# Altium project PCB.PrjPcb
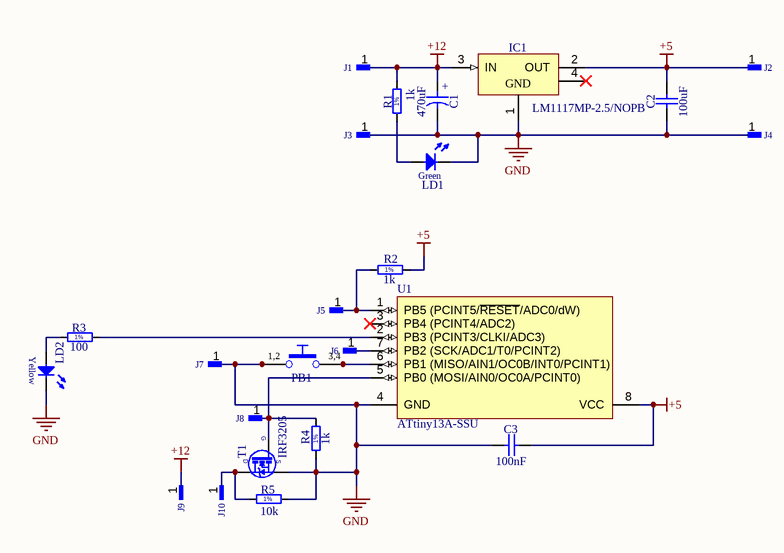
[diagram p0: Sheet1.SchDoc]
1 sheet, 24 parts. Net scope: global (net labels, ports and power ports of the same name join across sheets).
Board file: PCB1.PcbDoc

## Sheet Sheet1.SchDoc
size A4; Date: 24.01.2021; SheetNumber: 1; SheetTotal: 1

### Parts
C1  470uF  [CAPPR500-1050X1150]
C2  100uF  [CAPC3216X180N]
C3  100nF  [CAPC2012X135N]
IC1  LM1117MP-2.5/NOPB  [SOT230P700X180-4N]
J1  SMD Pad  [R400X300]  (value not drawn)
J2  SMD Pad  [R400X300]  (value not drawn)
J3  SMD Pad  [R400X300]  (value not drawn)
J4  SMD Pad  [R400X300]  (value not drawn)
J5  SMD Pad  [R350X200]  (value not drawn)
J6  SMD Pad  [R400X300]  (value not drawn)
J7  SMD Pad  [R350X200]  (value not drawn)
J8  SMD Pad  [R350X200]  (value not drawn)
J9  SMD Pad  [R400X300]  (value not drawn)
J10  SMD Pad  [R400X300]  (value not drawn)
LD1  Green  [LED_3MM_GREEN_1C-2A]  (value not drawn)
LD2  Yellow  [LED_3MM_YELLOW_1C-2A]  (value not drawn)
PB1  Push Button  [PB_ALPS_SKHHDTA010]  (value not drawn)
R1  1k  [RESC2012X60N]
R2  1k  [RESC2012X60N]
R3  100  [RESC2012X60N]
R4  1k  [RESC2012X60N]
R5  10k  [RESC2012X60N]
T1  IRF3205  [TO-220-V]
U1  ATtiny13A-SSU  [8S1_N]

### Nets
+5: C2.2 C3.2 IC1.2(OUT) J2.1 R2.2 U1.8(VCC)
+12: C1.1 IC1.3(IN) J1.1 J9.1 R1.2
GND: C1.2 C2.1 C3.1 IC1.1(GND) J3.1 J4.1 J7.1 LD1.1(C) LD2.1(C) PB1.1 PB1.2 R4.1 R5.2 T1.3(S) U1.4(GND)
NetJ5_1: J5.1 R2.1 U1.1(PB5_(PCINT5/~{RESET}/ADC0/dW))
NetJ6_1: J6.1 U1.7(PB2_(SCK/ADC1/T0/PCINT2))
NetJ8_1: J8.1 R4.2 T1.1(G) U1.5(PB0_(MOSI/AIN0/OC0A/PCINT0))
NetJ10_1: J10.1 R5.1 T1.2(D)
NetLD1_2: LD1.2(A) R1.1
NetLD2_2: LD2.2(A) R3.1
NetPB1_3: PB1.3 PB1.4 U1.6(PB1_(MISO/AIN1/OC0B/INT0/PCINT1))
NetR3_2: R3.2 U1.2(PB3_(PCINT3/CLKI/ADC3))

Not connected (* = marked no-connect by the designer): IC1 4(OUT)*; U1 3(PB4_(PCINT4/ADC2))*

### Notes on the sheet
- DWG. NO.
- REV.
- SHT.
- THIS DOCUMENT AND THE DATA DISCLOSED HEREIN OR HEREWITH IS THE PROPERTY OF ALTIUM LIMITED AND MAY BE FREELY DISTRIBUTED IN WHOLE. NO RIGHTS ARE RESERVED OR EXPRESS OR IMPLIED WARANTEE GIVEN.
- REVISION
- DESCRIPTION
- DATE
- APPROVED
- ENG:
- APPROVALS
- PROJECT
- DSN:
- CHK:
- REFERENCE DOCUMENTS
- PROJECT REVISION:
- TITLE
- DOCUMENT REVISION:
- DESIGN ITEM:
- BOM:
- FAB DWG:
- PCB DWG:
- ASSY DWG:
- SCALE:
- SIZE
- B
- CAGE CODE
- FILE NAME
- DWG NO.
- SHEET
- OF
- REV
- (in symbol CAER_470UF_10V_20%_500-1050X1150_LESR0R015) +
- (in symbol PB_ALPS_SKHHDTA010) 1,2; 3,4
- (in symbol R0805_1K_1%_0.33W_100PPM_VISHAY_CRCW-HP) 1%
- (in symbol R0805_10K_1%_0.125W_100PPM) 1%
- (in symbol R0805_100R_1%_0.125W_100PPM) 1%

### Library data of the parts
C1 = CAER_470UF_10V_20%_500-1050X1150_LESR0R015: Polarised capacitor; Part Description: Low ESR 0R015 Aluminum Solid Capacitor With Organic Semiconductive Electrolyte; Manufacturer: SANYO OS-CON; Manufacturer Part Number: 10SP470M; Voltage: 10V; Tolerance: ±20%; Part Number: CAER_470UF_10V_20%_500-1050X1150_LESR0R015; Component Kind: Standard; Component Type: Standard; Pin Count: 2; Value: 470uF; Status: Obsolete; Case: LS5 D10.5 x H11.5; Mounted: Yes; Socket: No; SMD: No; Sense: No; ComponentHeight: 11.5mm; HelpURL: \\cern.ch\dfs\Applications\Altium\Datasheets\CAER-LESR_SANYO_SP.pdf; Author: CERN DEM JLC; CreateDate: 29.01.2008; LatestRevisionDate: 16.03.2009
C2 = CC1206_100UF_6.3V_20%_X5R: Non-polarised capacitor; Part Description: SMD Multilayer Chip Ceramic Capacitor; Manufacturer: GENERIC; Manufacturer1 Part Number: C1206C107M9PACTU; Voltage: 6.3V; TC: X5R; Tolerance: ±10%; Part Number: CC1206_100UF_6.3V_20%_X5R; Component Kind: Standard; Component Type: Standard; Pin Count: 2; Value: 100uF; Status: None; Manufacturer Part Number: CC1206_100UF_6.3V_20%_X5R; Case: 1206; Mounted: Yes; Socket: No; SMD: Yes; Sense: No; Manufacturer1 Example: KEMET; Manufacturer1 ComponentHeight: 1.8mm; HelpURL: \\cern.ch\dfs\Applications\Altium\Datasheets\CC1206_X5R_KEMET.pdf; Author: CERN DEM JLC; CreateDate: 26.09.2012; LatestRevisionDate: 26.09.2012
C3 = CC0805_100NF_50V_10%_X7R: Non-polarised capacitor; Part Description: SMD Multilayer Chip Ceramic Capacitor; Manufacturer: GENERIC; Manufacturer1 Part Number: C2012X7R1H104K085AA; Voltage: 50V; TC: X7R; Tolerance: ±10%; Part Number: CC0805_100NF_50V_10%_X7R; Component Kind: Standard; Component Type: Standard; Pin Count: 2; Value: 100nF; Status: Preferred; Manufacturer Part Number: CC0805_100NF_50V_10%_X7R; Case: 0805; Mounted: Yes; Socket: No; SMD: Yes; Sense: No; Manufacturer1 Example: TDK; Manufacturer1 ComponentHeight: 1mm; HelpURL: \\cern.ch\dfs\Applications\Altium\Datasheets\CC0805_X7R_TDK_C.pdf; Author: CERN DEM JLC; CreateDate: 03.12.2007; LatestRevisionDate: 22.04.2015
IC1 = LM1117MP-2.5/NOPB: 3-Terminal Regulator 1=GND 2=OUT 3=IN 4=OUT; Part Description: 2.5V 800mA Low-Dropout Linear Regulator; Manufacturer: TEXAS INSTRUMENTS; PressFit: No; Bonding: No; Part Number: LM1117MP-2.5/NOPB; Component Kind: Standard; Component Type: Standard; Device: LM1117MP-2.5/NOPB; PackageDescription: SOT223, 2.30mm pitch; 3 pin, 3.70mm W X 6.70mm L, IPC Medium Density; Manufacturer Part Number: LM1117MP-2.5/NOPB; Pin Count: 4; Case: SOT223; Mounted: Yes; Socket: No; SMD: Yes; Sense: No; ComponentHeight: 1.8mm; HelpURL: \\cern.ch\dfs\Applications\Altium\Datasheets\LM1117MP-2.5-NOPB.pdf; Author: CERN DEM JLC; CreateDate: 23.02.2015; LatestRevisionDate: 23.02.2015
J1-J4 J6 J9 J10 = SMD_PAD_4X3MM: Single SMD Pad; Part Description: 4mm x 3mm SMD Pad; Mounted: No; Part Number: SMD_PAD_4X3MM; Component Kind: Standard (No BOM); Component Type: Standard (No BOM); Pin Count: 1; Family: SMD Pad; Socket: No; SMD: No; Sense: No; Status: None; ComponentHeight: 0mm; HelpURL: Undefined; Author: CERN DEM JLC; CreateDate: 15.03.2010; LatestRevisionDate: 15.03.2010; PackageDescription: 4mm x  3mm SMD Pad
J5 J7 J8 = SMD_PAD_3.5X2MM: Single SMD Pad; Part Description: 3.5mm x 2mm SMD Pad; Mounted: No; Part Number: SMD_PAD_3.5X2MM; Component Kind: Standard (No BOM); Component Type: Standard (No BOM); Pin Count: 1; Family: SMD Pad; Socket: No; SMD: No; Sense: No; Status: None; ComponentHeight: 0mm; HelpURL: Undefined; Author: CERN DEM JLC; CreateDate: 15.03.2010; LatestRevisionDate: 15.03.2010; PackageDescription: 3.5mm x  2mm SMD Pad
LD1 = LED_AVAGO_HLMP-1790: LED Green 1C 2A; Part Description: 3mm Green LED; Manufacturer: AVAGO TECHNOLOGIES; PressFit: No; Bonding: No; Part Number: LED_AVAGO_HLMP-1790; Component Kind: Standard; Component Type: Standard; Color: Green; PackageDescription: LED, Green, Body Dia. 3.43 mm, Pin spacing 2.54mm; Manufacturer Part Number: HLMP-1790; Pin Count: 2; Mounted: Yes; Socket: No; SMD: No; Sense: No; ComponentHeight: 6.35mm(min); HelpURL: \\cern.ch\dfs\Applications\Altium\Datasheets\LED_AVAGO_HLMP-1790.pdf; Author: CERN DEM JLC; CreateDate: 12.06.2008; LatestRevisionDate: 17.03.2010
LD2 = LED_AVAGO_HLMP-1719: LED Yellow 1C 2A; Part Description: 3mm Yellow LED; Manufacturer: AVAGO TECHNOLOGIES; PressFit: No; Bonding: No; Part Number: LED_AVAGO_HLMP-1719; Component Kind: Standard; Component Type: Standard; Color: Yellow; PackageDescription: LED, Yellow, Body Dia. 3.43 mm, Pin spacing 2.54mm; Manufacturer Part Number: HLMP-1719; Pin Count: 2; Mounted: Yes; Socket: No; SMD: No; Sense: No; ComponentHeight: 6.35mm(min); HelpURL: \\cern.ch\dfs\Applications\Altium\Datasheets\LED_AVAGO_HLMP-1719.pdf; Author: CERN DEM JLC; CreateDate: 12.06.2008; LatestRevisionDate: 17.03.2010
PB1 = PB_ALPS_SKHHDTA010: Push-Button Switch SPDT; Part Description: 12VDC 50mA, 6x6mm Model, 13mm Stem Height Vertical Pushbutton Switch, ALPS SKHH Series; Manufacturer: ALPS; PressFit: No; Part Number: PB_ALPS_SKHHDTA010; Component Kind: Standard; Component Type: Standard; Pin Count: 4; PackageDescription: 6x6mm Model, 13mm Stem Height Vertical Pushbutton Switch, ALPS SKHH Series; Family: Push Button; Mounted: Yes; Socket: No; SMD: No; Sense: No; Status: None; Manufacturer Part Number: SKHHDTA010; ComponentHeight: 13mm; HelpURL: \\cern.ch\dfs\Applications\Altium\Datasheets\PB_ALPS_SKHHDTA010.pdf; Author: CERN DEM JLC; CreateDate: 26.09.2013; LatestRevisionDate: 26.09.2013
R1 R2 R4 = R0805_1K_1%_0.33W_100PPM_VISHAY_CRCW-HP: Resistor - 1%; Part Description: 150V, Pulse Proof, High Power Thick Film Chip Resistor; Manufacturer: VISHAY DRALORIC; Manufacturer Part Number: CRCW08051K00FKEAHP; Power: 0.33W; TC: ±100ppm/°C; PressFit: No; Part Number: R0805_1K_1%_0.33W_100PPM_VISHAY_CRCW-HP; Component Kind: Standard; Component Type: Standard; Pin Count: 2; Value: 1k; Status: None; Tolerance: ±1%; Case: 0805; Mounted: Yes; Sense: No; Socket: No; SMD: Yes; Manufacturer1 ComponentHeight: 0.6mm; HelpURL: \\cern.ch\dfs\Applications\Altium\Datasheets\R0805_VISHAY_CRCW-HP e3.pdf; Author: CERN DEM JLC; CreateDate: 16.06.2010; LatestRevisionDate: 16.06.2010
R3 = R0805_100R_1%_0.125W_100PPM: Resistor - 1%; Part Description: General Purpose Thick Film Chip Resistor; Manufacturer: GENERIC; Manufacturer1 Part Number: NRC10F4700TRF; Power: 0.125W; TC: ±100ppm/°C; PressFit: No; Part Number: R0805_100R_1%_0.125W_100PPM; Component Kind: Standard; Component Type: Standard; Pin Count: 2; Value: 100; Status: Preferred; Tolerance: ±1%; Manufacturer Part Number: R0805_100R_1%_0.125W_100PPM; Case: 0805; Mounted: Yes; Sense: No; Socket: No; SMD: Yes; Manufacturer1 Example: NIC COMPONENT; Manufacturer1 ComponentHeight: 0.6mm; HelpURL: \\cern.ch\dfs\Applications\Altium\Datasheets\R0805_NIC_NRC.pdf; Author: CERN DEM JLC; CreateDate: 03.12.2007; LatestRevisionDate: 13.03.2008
R5 = R0805_10K_1%_0.125W_100PPM: Resistor - 1%; Part Description: General Purpose Thick Film Chip Resistor; Manufacturer: GENERIC; Manufacturer1 Part Number: NRC10F1002TRF; Power: 0.125W; TC: ±100ppm/°C; PressFit: No; Part Number: R0805_10K_1%_0.125W_100PPM; Component Kind: Standard; Component Type: Standard; Pin Count: 2; Value: 10k; Status: Preferred; Tolerance: ±1%; Manufacturer Part Number: R0805_10K_1%_0.125W_100PPM; Case: 0805; Mounted: Yes; Sense: No; Socket: No; SMD: Yes; Manufacturer1 Example: NIC COMPONENT; Manufacturer1 ComponentHeight: 0.6mm; HelpURL: \\cern.ch\dfs\Applications\Altium\Datasheets\R0805_NIC_NRC.pdf; Author: CERN DEM JLC; CreateDate: 03.12.2007; LatestRevisionDate: 13.03.2008
T1 = IRF640NPBF_v: N-CHANNEL MOSFET WITH ZENER DIODE; Part Description: 200V 18A N-Channel HEXFET® Power MOSFET; Manufacturer: INTERNATIONAL RECTIFIER; PressFit: No; Bonding: No; Part Number: IRF640NPBF_v; Component Kind: Standard; Component Type: Standard; Device: IRF640NPBF; PackageDescription: TO-220 3-Terminal - Vertical; Manufacturer Part Number: IRF640NPBF; Pin Count: 3; Case: TO-220; Mounted: Yes; Socket: No; SMD: No; Sense: No; ComponentHeight: 19.3mm; HelpURL: \\cern.ch\dfs\Applications\Altium\Datasheets\IRF640NPBF.pdf; Author: CERN DEM JLC; CreateDate: 16.01.2012; LatestRevisionDate: 16.01.2012
U1 = ATtiny13A-SSU: 8-bit AVR Microcontroller, 1.8-5.5V, 1KB Flash, 64 Bytes EEPROM, 64 Bytes SRAM, 8-pin SOIC, Industrial Grade (-40°C to 85°C), Pb-Free; Published: 1-Apr-2010; DatasheetVersion: revD, Nov-2009; PackageVersion: revC, Mar-2005; PackageReference: 8S1; Publisher: Altium Limited; PackageDescription: 8-Lead (0.150" Wide Body), Plastic Gull Wing Small Outline (JEDEC SOIC); Supplier 1: Digi-Key; Supplier Part Number 1: ATTINY13A-SSU-ND; Supplier 2: Farnell; Supplier Part Number 2: 1704567; Supplier 3: Mouser; Supplier Part Number 3: 556-ATTINY13A-SSU; Code_JEDEC: MS-012-AA; Code_IPC: SOIC127P600-8; ComponentLink1Description: Manufacturer Link; ComponentLink1URL: http://www.atmel.com/products/avr/default.asp?; ComponentLink2Description: ATtiny13A Datasheet; ComponentLink2URL: http://www.atmel.com/dyn/resources/prod_documents/doc8126.pdf; ComponentLink3Description: ATtiny13A Summary; ComponentLink3URL: http://www.atmel.com/dyn/resources/prod_documents/8126S.pdf; ComponentLink4Description: Atmel.com Home; ComponentLink4URL: http://www.atmel.com